# Altium schematic sheet USB_UART_Bridge.SchDoc: USB_UART
size A4; Date: 15.03.2026; Author: Vamsi Krishna Sesham; DrawnBy: Vamsi Krishna Sesham; Engineer: Vamsi Krishna Sesham; Revision: C; SheetNumber: 5; SheetTotal: 6
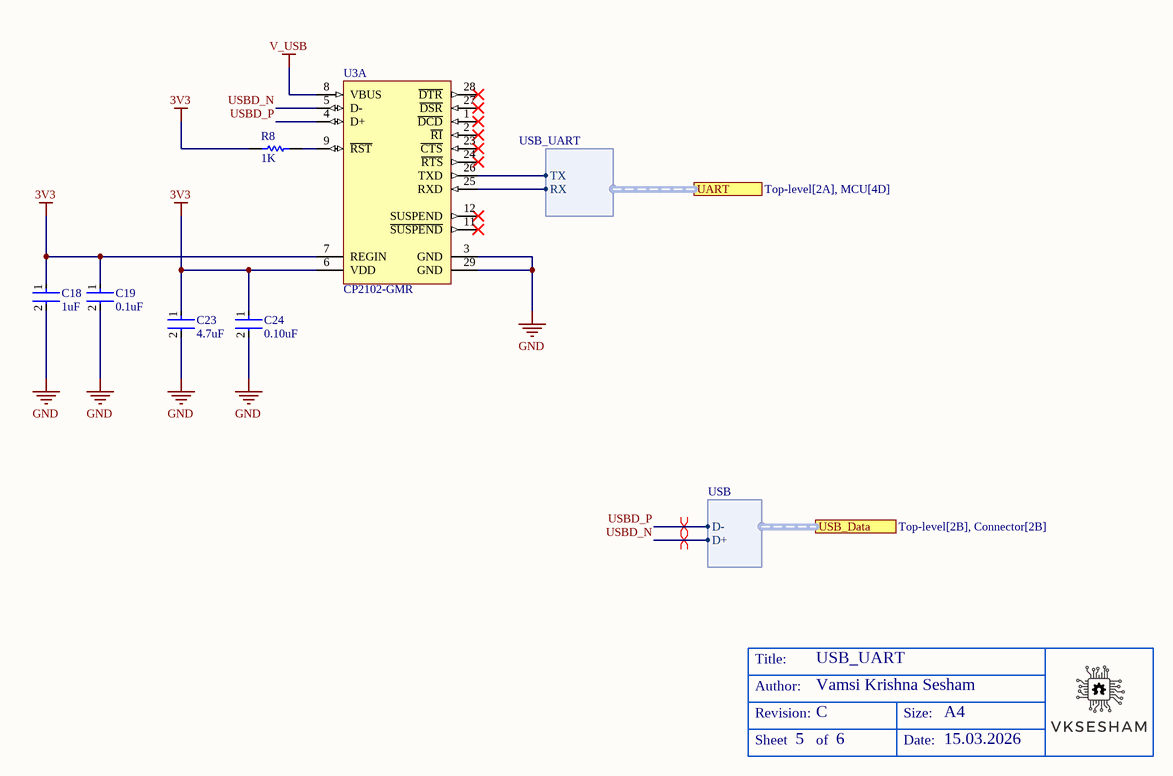
[diagram p0: USB_UART_Bridge.SchDoc]

## Parts
*  TitleBlock  (value not drawn)  (graphical)
C18  1uF  [FP-GRM033-0_09-IPC_A]
C19  0.1uF  [FP-GRM033-0_03-MFG]
C23  4.7uF  [FP-CC0402-MFG]
C24  0.10uF  [FP-GRM033-0_03-MFG]
R8  1K  [RESC0603X28X15ML05T05]
U3  CP2102-GMR  [SLAB-QFN-28-3125x3125TP_M]  (part A of 2)

## Ports
UART (harness USB_UART, see Top-level[2A], MCU[4D]), USB_Data (harness USB, see Top-level[2B], Connector[2B])

## Harnesses
USB: D-, D+
USB_UART: TX, RX

## Nets
3V3: C18.1 C19.1 C23.1 C24.1 R8.1 U3.6(VDD) U3.7(REGIN)
GND: C18.2 C19.2 C23.2 C24.2 U3.3(GND) U3.29(GND)
V_USB: U3.8(VBUS)
USBD_N: U3.5(D-) ; port USB_Data.D+
USBD_P: U3.4(D+) ; port USB_Data.D-
NetR8_2: R8.2 U3.9(~{RST})
NetU3_25: U3.25(RXD) ; port UART.RX
NetU3_26: U3.26(TXD) ; port UART.TX

Not connected (* = marked no-connect by the designer): U3 1(~{DCD})* 2(~{RI})* 11(~{SUSPEND})* 12(SUSPEND)* 23(~{CTS})* 24(~{RTS})* 27(~{DSR})* 28(~{DTR})*

## Layout directives
differential pair: USBD_N, USBD_P

## Notes on the sheet
- (in symbol TitleBlock) Title:; Author:; Revision:; Size:; A4; Sheet; of; Date:

## Library data of the parts
C18 = CMP-06035-002798-1: Chip Multilayer Ceramic Capacitors for General Purpose, 0201, 1.0uF, X5R, 15%, 20%, 10V; Capacitance: 1uF; Tolerance: 20%; Case Code (Metric): 0603; Voltage Rating (DC): 10V; Min Operating Temperature: -55°C; Mount: Surface Mount; Width: 0.012inch; Dielectric: X5R; Packaging: Tape and Reel; Voltage Rating: 10V; Thickness: 0.015inch; Case Code (Imperial): 0201; Length: 0.024inch; Case/Package: 0201; Max Operating Temperature: 85°C
C19 C24 = CMP-06035-019037-1: Chip Multilayer Ceramic Capacitors for General Purpose, 0201, 0.10uF, X7S, 22%, 10%, 16V; Capacitance: 100nF; Dielectric: X7S; Tolerance: 10%; Voltage Rating (DC): 16V; Height: 0.3mm; Max Operating Temperature: 125°C; Case Code (Metric): 0603; Termination: SMD/SMT; Min Operating Temperature: -55°C; Mount: Surface Mount; Case/Package: 0201; Weight: 1.2E-05oz; Package Quantity: 15000; Length: 0.024inch; Voltage Rating: 16V; Case Code (Imperial): 0201; Packaging: Tape and Reel; Thickness: 0.013inch; Width: 0.3mm
C23 = CMP-03422-000819-1: CAP CER 4.7UF 16V X5R 0402; Manufacturer Part Number: CC0402MRX5R7BB475; Manufacturer: YAGEO; Tolerance: 0.2; Automotive Grade: NA; Material: Ceramic; Temperature Coefficient: 30ppm/°C; Digikey Description: CAP CER 4.7UF 16V X5R 0402; Capacitance: 4.7 uF; Lead Free: Yes; Octopart: https://octopart.com/cc0402mrx5r7bb475-yageo-81932628; Device Class L3: Ceramic Capacitors; Ipc Land Pattern Name: CAPC10050X50; Package: CC0402; Temperature: -55°C to +125°C; Device Class L2: Capacitors; Value: 4.7 uF; Temperature Characteristic: X5R; ComponentLink2URL: http://www.yageo.com/documents/recent/UPY-GP_NP0_16V-to-50V_16.pdf; Temperature Range Low: -55°C; Automotive: No; ComponentLink2Description: Datasheet; Category: Cap; Mouser Description: Multilayer Ceramic Capacitors MLCC - SMD/SMT 4.7uF 16V 20% Ceramic Capacitor; Temperature Range High: +125°C; Voltage Rating: 16 V; Footprint Url: http://www.yageo.com/exep/pages/download/literatures/UPY-C_GEN_24.pdf; Height: 0.55mm; RoHS: TRUE; Device Class L1: Passive Components
R8 = CMP-2004-00209-1: Manufacturer: Vishay Dale; Part Number: CRCW02011K00FNED
U3 = CMP-2000-04924-1: Single-Chip USB to URAT Bridge, 3.3 V, -40 to 85 degC, 28-Pin QFN, RoHS, Tape and Reel; Manufacturer: Silicon Labs; Interface Circuit Standard 1: RS-232; Transmitter and Receiver FIFO Counter: No; Supply Current: 26mA; Operating Supply Voltage (Min): 3V; Operating Supply Voltage (Typ): 3.3V; Data Rate: 1000kbps; Operating Supply Voltage (Max): 3.6V; Number of Channels: 1; Package URL: http://www.silabs.com/Support%20Documents/TechnicalDocs/C8051T61x.pdf; Operating Temperature (Max): 85C; Datasheet URL: http://www.mouser.com/ds/2/368/CP2102-9-247052.pdf; Operating Temperature Classification: Industrial; Operating Temperature (Min): -40C; Package Description: 28-Pin Quad-Flat No-Leads Package, Body 5 x 5 mm, Pitch 0.5 mm; Manufacturer URL: http://www.silabs.com/; Rad Hardened: No; Package Reference: QFN-28; Pin Count: 28; Packaging: TapeandReel; Mounting: SurfaceMount; Package Type: QFNEP; Datasheet Version: Rev. 1.6, 12/2013